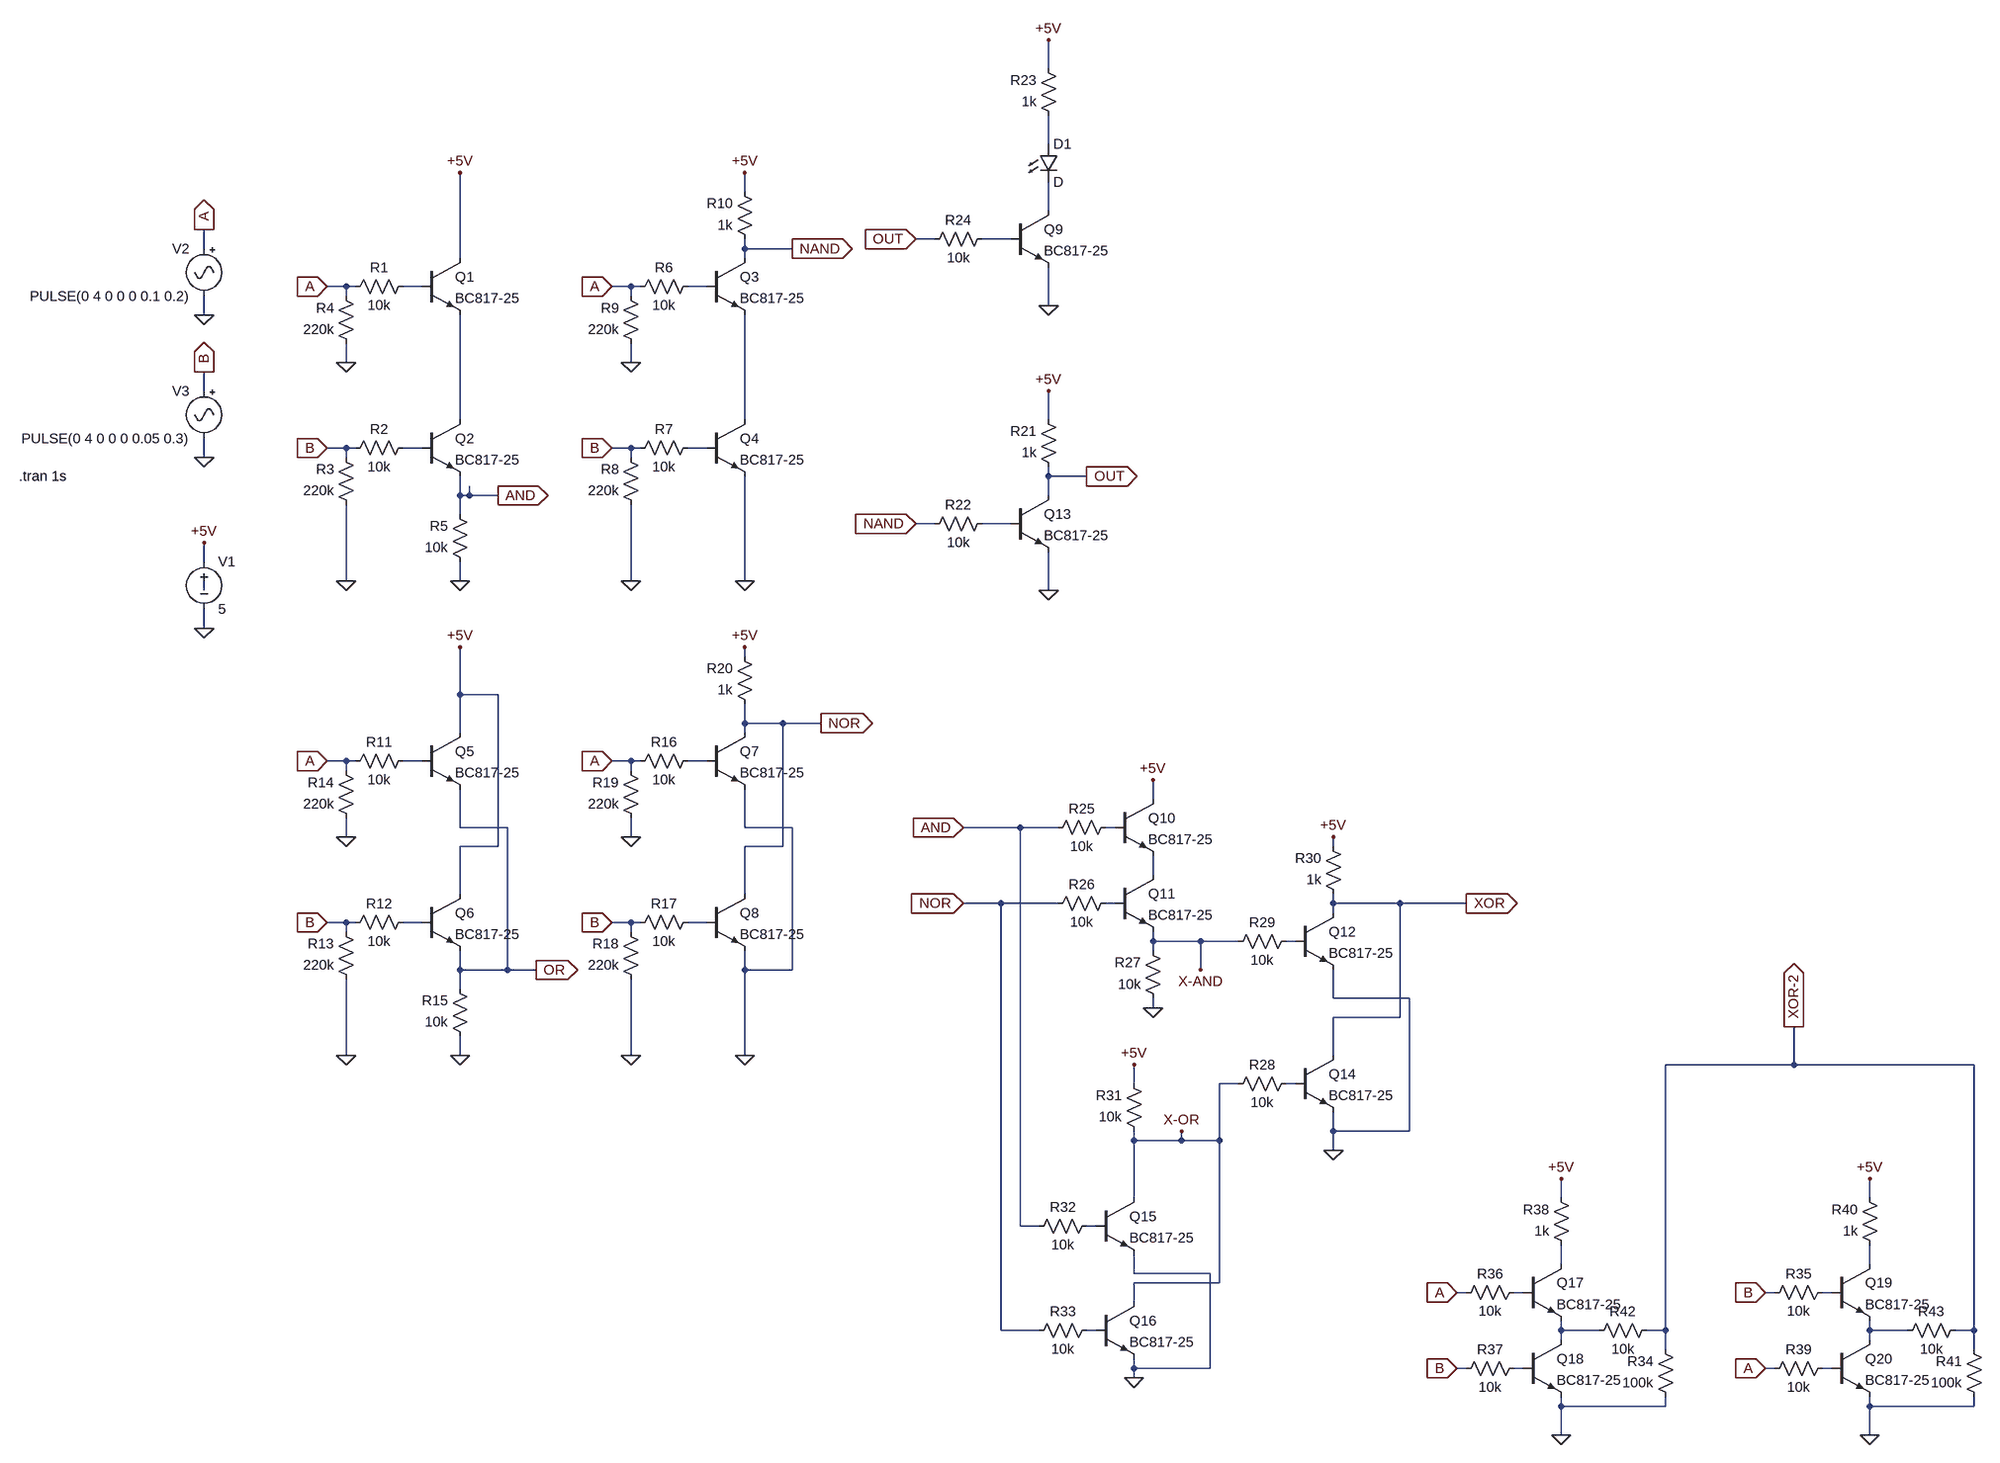
[diagram p0: schematic basic-gates.asc]
basic-gates.asc, the LTspice schematic file:
Version 4
SHEET 1 3012 1972
WIRE 1184 -352 1184 -400
WIRE 1184 -224 1184 -272
WIRE 672 -144 672 -176
WIRE 1184 -112 1184 -160
WIRE 992 -64 960 -64
WIRE 1120 -64 1072 -64
WIRE -256 -48 -256 -80
WIRE 672 -48 672 -64
WIRE 752 -48 672 -48
WIRE 192 -32 192 -176
WIRE 672 -32 672 -48
WIRE 0 16 -32 16
WIRE 16 16 0 16
WIRE 128 16 96 16
WIRE 480 16 448 16
WIRE 496 16 480 16
WIRE 608 16 576 16
WIRE 0 32 0 16
WIRE 480 32 480 16
WIRE 1184 48 1184 -16
WIRE -256 64 -256 32
WIRE 0 144 0 112
WIRE 480 144 480 112
WIRE -256 192 -256 160
WIRE 192 240 192 64
WIRE 672 240 672 64
WIRE 1184 240 1184 192
WIRE 0 288 -32 288
WIRE 16 288 0 288
WIRE 128 288 96 288
WIRE 480 288 448 288
WIRE 496 288 480 288
WIRE 608 288 576 288
WIRE -256 304 -256 272
WIRE 0 304 0 288
WIRE 480 304 480 288
WIRE 1184 336 1184 320
WIRE 1248 336 1184 336
WIRE 192 368 192 336
WIRE 208 368 208 352
WIRE 208 368 192 368
WIRE 256 368 208 368
WIRE 1184 368 1184 336
WIRE 192 400 192 368
WIRE 992 416 960 416
WIRE 1120 416 1072 416
WIRE -256 480 -256 448
WIRE 0 512 0 384
WIRE 192 512 192 480
WIRE 480 512 480 384
WIRE 672 512 672 336
WIRE -256 528 -256 512
WIRE 1184 528 1184 464
WIRE -256 592 -256 560
WIRE 672 640 672 624
WIRE 192 704 192 624
WIRE 256 704 192 704
WIRE 672 752 672 720
WIRE 736 752 672 752
WIRE 800 752 736 752
WIRE 192 768 192 704
WIRE 672 768 672 752
WIRE 0 816 -32 816
WIRE 16 816 0 816
WIRE 128 816 96 816
WIRE 480 816 448 816
WIRE 496 816 480 816
WIRE 608 816 576 816
WIRE 0 832 0 816
WIRE 480 832 480 816
WIRE 1360 880 1360 848
WIRE 192 928 192 864
WIRE 272 928 192 928
WIRE 672 928 672 864
WIRE 752 928 672 928
WIRE 1136 928 1040 928
WIRE 1200 928 1136 928
WIRE 1296 928 1280 928
WIRE 0 944 0 912
WIRE 480 944 480 912
WIRE 256 960 256 704
WIRE 256 960 192 960
WIRE 736 960 736 752
WIRE 736 960 672 960
WIRE 1664 960 1664 944
WIRE 1360 1008 1360 976
WIRE 192 1040 192 960
WIRE 672 1040 672 960
WIRE 1104 1056 1040 1056
WIRE 1200 1056 1104 1056
WIRE 1296 1056 1280 1056
WIRE 1664 1056 1664 1040
WIRE 1776 1056 1664 1056
WIRE 1888 1056 1776 1056
WIRE 1664 1072 1664 1056
WIRE 0 1088 -32 1088
WIRE 16 1088 0 1088
WIRE 128 1088 96 1088
WIRE 480 1088 448 1088
WIRE 496 1088 480 1088
WIRE 608 1088 576 1088
WIRE 0 1104 0 1088
WIRE 480 1104 480 1088
WIRE 1360 1120 1360 1104
WIRE 1440 1120 1360 1120
WIRE 1504 1120 1440 1120
WIRE 1600 1120 1584 1120
WIRE 1360 1136 1360 1120
WIRE 192 1168 192 1136
WIRE 272 1168 272 928
WIRE 272 1168 192 1168
WIRE 320 1168 272 1168
WIRE 672 1168 672 1136
WIRE 752 1168 752 928
WIRE 752 1168 672 1168
WIRE 1440 1168 1440 1120
WIRE 192 1200 192 1168
WIRE 1664 1216 1664 1168
WIRE 1792 1216 1664 1216
WIRE 1360 1232 1360 1216
WIRE 1776 1248 1776 1056
WIRE 1776 1248 1664 1248
WIRE 0 1312 0 1184
WIRE 192 1312 192 1280
WIRE 480 1312 480 1184
WIRE 672 1312 672 1168
WIRE 1664 1312 1664 1248
WIRE 2480 1328 2480 1264
WIRE 2480 1328 2224 1328
WIRE 2784 1328 2480 1328
WIRE 1328 1360 1328 1328
WIRE 1504 1360 1472 1360
WIRE 1600 1360 1584 1360
WIRE 1664 1440 1664 1408
WIRE 1792 1440 1792 1216
WIRE 1792 1440 1664 1440
WIRE 1328 1456 1328 1440
WIRE 1408 1456 1408 1440
WIRE 1408 1456 1328 1456
WIRE 1472 1456 1472 1360
WIRE 1472 1456 1408 1456
WIRE 1664 1472 1664 1440
WIRE 1328 1552 1328 1456
WIRE 2048 1552 2048 1520
WIRE 2608 1552 2608 1520
WIRE 1136 1600 1136 928
WIRE 1168 1600 1136 1600
WIRE 1264 1600 1248 1600
WIRE 2048 1664 2048 1632
WIRE 2608 1664 2608 1632
WIRE 1328 1680 1328 1648
WIRE 1456 1680 1328 1680
WIRE 1472 1696 1472 1456
WIRE 1472 1696 1328 1696
WIRE 1888 1712 1872 1712
WIRE 1984 1712 1968 1712
WIRE 2448 1712 2432 1712
WIRE 2544 1712 2528 1712
WIRE 1328 1728 1328 1696
WIRE 1104 1776 1104 1056
WIRE 1168 1776 1104 1776
WIRE 1264 1776 1248 1776
WIRE 2048 1776 2048 1760
WIRE 2112 1776 2048 1776
WIRE 2224 1776 2224 1328
WIRE 2224 1776 2192 1776
WIRE 2608 1776 2608 1760
WIRE 2672 1776 2608 1776
WIRE 2784 1776 2784 1328
WIRE 2784 1776 2752 1776
WIRE 2048 1792 2048 1776
WIRE 2608 1792 2608 1776
WIRE 2224 1808 2224 1776
WIRE 2784 1808 2784 1776
WIRE 1328 1840 1328 1824
WIRE 1456 1840 1456 1680
WIRE 1456 1840 1328 1840
WIRE 1888 1840 1872 1840
WIRE 1984 1840 1968 1840
WIRE 2448 1840 2432 1840
WIRE 2544 1840 2528 1840
WIRE 1328 1856 1328 1840
WIRE 2048 1904 2048 1888
WIRE 2224 1904 2224 1888
WIRE 2224 1904 2048 1904
WIRE 2608 1904 2608 1888
WIRE 2784 1904 2784 1888
WIRE 2784 1904 2608 1904
WIRE 2048 1952 2048 1904
WIRE 2608 1952 2608 1904
FLAG 192 512 0
FLAG 0 144 0
FLAG 0 512 0
FLAG -256 592 0
FLAG -256 64 0
FLAG -256 304 0
FLAG -256 448 +5V
FLAG 192 -176 +5V
FLAG -256 -80 A
IOPIN -256 -80 Out
FLAG -256 160 B
IOPIN -256 160 Out
FLAG -32 16 A
IOPIN -32 16 In
FLAG -32 288 B
IOPIN -32 288 In
FLAG 256 368 AND
IOPIN 256 368 Out
FLAG 672 512 0
FLAG 480 144 0
FLAG 480 512 0
FLAG 1184 192 +5V
FLAG 448 16 A
IOPIN 448 16 In
FLAG 448 288 B
IOPIN 448 288 In
FLAG 752 -48 NAND
IOPIN 752 -48 Out
FLAG 192 1312 0
FLAG 0 944 0
FLAG 0 1312 0
FLAG 192 624 +5V
FLAG -32 816 A
IOPIN -32 816 In
FLAG -32 1088 B
IOPIN -32 1088 In
FLAG 320 1168 OR
IOPIN 320 1168 Out
FLAG 672 1312 0
FLAG 480 944 0
FLAG 480 1312 0
FLAG 672 624 +5V
FLAG 448 816 A
IOPIN 448 816 In
FLAG 448 1088 B
IOPIN 448 1088 In
FLAG 800 752 NOR
IOPIN 800 752 Out
FLAG 1184 528 0
FLAG 960 416 NAND
IOPIN 960 416 In
FLAG 1248 336 OUT
IOPIN 1248 336 Out
FLAG 672 -176 +5V
FLAG 1184 -400 +5V
FLAG 1184 48 0
FLAG 960 -64 OUT
IOPIN 960 -64 In
FLAG 1360 848 +5V
FLAG 1360 1232 0
FLAG 1040 928 AND
IOPIN 1040 928 In
FLAG 1040 1056 NOR
IOPIN 1040 1056 In
FLAG 1664 1472 0
FLAG 1664 944 +5V
FLAG 1888 1056 XOR
IOPIN 1888 1056 Out
FLAG 1328 1328 +5V
FLAG 1328 1856 0
FLAG 1440 1168 X-AND
FLAG 1408 1440 X-OR
FLAG 2048 1520 +5V
FLAG 2048 1952 0
FLAG 1872 1840 B
IOPIN 1872 1840 In
FLAG 1872 1712 A
IOPIN 1872 1712 In
FLAG 2608 1520 +5V
FLAG 2608 1952 0
FLAG 2432 1840 A
IOPIN 2432 1840 In
FLAG 2432 1712 B
IOPIN 2432 1712 In
FLAG 2480 1264 XOR-2
IOPIN 2480 1264 Out
SYMBOL npn 128 -32 R0
SYMATTR InstName Q1
SYMATTR Value BC817-25
SYMBOL npn 128 240 R0
SYMATTR InstName Q2
SYMATTR Value BC817-25
SYMBOL voltage -256 464 R0
WINDOW 123 0 0 Left 2
WINDOW 39 0 0 Left 2
SYMATTR InstName V1
SYMATTR Value 5
SYMBOL res 112 0 R90
WINDOW 0 0 56 VBottom 2
WINDOW 3 32 56 VTop 2
SYMATTR InstName R1
SYMATTR Value 10k
SYMBOL res 112 272 R90
WINDOW 0 0 56 VBottom 2
WINDOW 3 32 56 VTop 2
SYMATTR InstName R2
SYMATTR Value 10k
SYMBOL res 16 400 R180
WINDOW 0 36 76 Left 2
WINDOW 3 36 40 Left 2
SYMATTR InstName R3
SYMATTR Value 220k
SYMBOL res 16 128 R180
WINDOW 0 36 76 Left 2
WINDOW 3 36 40 Left 2
SYMATTR InstName R4
SYMATTR Value 220k
SYMBOL res 208 496 R180
WINDOW 0 36 76 Left 2
WINDOW 3 36 40 Left 2
SYMATTR InstName R5
SYMATTR Value 10k
SYMBOL Misc\\signal -256 -64 M0
WINDOW 123 0 0 Left 2
WINDOW 39 0 0 Left 2
SYMATTR InstName V2
SYMATTR Value PULSE(0 4 0 0 0 0.1 0.2)
SYMBOL Misc\\signal -256 176 M0
WINDOW 123 0 0 Left 2
WINDOW 39 0 0 Left 2
SYMATTR InstName V3
SYMATTR Value PULSE(0 4 0 0 0 0.05 0.3)
SYMBOL npn 608 -32 R0
SYMATTR InstName Q3
SYMATTR Value BC817-25
SYMBOL npn 608 240 R0
SYMATTR InstName Q4
SYMATTR Value BC817-25
SYMBOL res 592 0 R90
WINDOW 0 0 56 VBottom 2
WINDOW 3 32 56 VTop 2
SYMATTR InstName R6
SYMATTR Value 10k
SYMBOL res 592 272 R90
WINDOW 0 0 56 VBottom 2
WINDOW 3 32 56 VTop 2
SYMATTR InstName R7
SYMATTR Value 10k
SYMBOL res 496 400 R180
WINDOW 0 36 76 Left 2
WINDOW 3 36 40 Left 2
SYMATTR InstName R8
SYMATTR Value 220k
SYMBOL res 496 128 R180
WINDOW 0 36 76 Left 2
WINDOW 3 36 40 Left 2
SYMATTR InstName R9
SYMATTR Value 220k
SYMBOL res 688 -48 R180
WINDOW 0 36 76 Left 2
WINDOW 3 36 40 Left 2
SYMATTR InstName R10
SYMATTR Value 1k
SYMBOL npn 128 768 R0
SYMATTR InstName Q5
SYMATTR Value BC817-25
SYMBOL npn 128 1040 R0
SYMATTR InstName Q6
SYMATTR Value BC817-25
SYMBOL res 112 800 R90
WINDOW 0 0 56 VBottom 2
WINDOW 3 32 56 VTop 2
SYMATTR InstName R11
SYMATTR Value 10k
SYMBOL res 112 1072 R90
WINDOW 0 0 56 VBottom 2
WINDOW 3 32 56 VTop 2
SYMATTR InstName R12
SYMATTR Value 10k
SYMBOL res 16 1200 R180
WINDOW 0 36 76 Left 2
WINDOW 3 36 40 Left 2
SYMATTR InstName R13
SYMATTR Value 220k
SYMBOL res 16 928 R180
WINDOW 0 36 76 Left 2
WINDOW 3 36 40 Left 2
SYMATTR InstName R14
SYMATTR Value 220k
SYMBOL res 208 1296 R180
WINDOW 0 36 76 Left 2
WINDOW 3 36 40 Left 2
SYMATTR InstName R15
SYMATTR Value 10k
SYMBOL npn 608 768 R0
SYMATTR InstName Q7
SYMATTR Value BC817-25
SYMBOL npn 608 1040 R0
SYMATTR InstName Q8
SYMATTR Value BC817-25
SYMBOL res 592 800 R90
WINDOW 0 0 56 VBottom 2
WINDOW 3 32 56 VTop 2
SYMATTR InstName R16
SYMATTR Value 10k
SYMBOL res 592 1072 R90
WINDOW 0 0 56 VBottom 2
WINDOW 3 32 56 VTop 2
SYMATTR InstName R17
SYMATTR Value 10k
SYMBOL res 496 1200 R180
WINDOW 0 36 76 Left 2
WINDOW 3 36 40 Left 2
SYMATTR InstName R18
SYMATTR Value 220k
SYMBOL res 496 928 R180
WINDOW 0 36 76 Left 2
WINDOW 3 36 40 Left 2
SYMATTR InstName R19
SYMATTR Value 220k
SYMBOL res 688 736 R180
WINDOW 0 36 76 Left 2
WINDOW 3 36 40 Left 2
SYMATTR InstName R20
SYMATTR Value 1k
SYMBOL npn 1120 368 R0
SYMATTR InstName Q13
SYMATTR Value BC817-25
SYMBOL res 1200 336 R180
WINDOW 0 36 76 Left 2
WINDOW 3 36 40 Left 2
SYMATTR InstName R21
SYMATTR Value 1k
SYMBOL res 1088 400 R90
WINDOW 0 0 56 VBottom 2
WINDOW 3 32 56 VTop 2
SYMATTR InstName R22
SYMATTR Value 10k
SYMBOL npn 1120 -112 R0
SYMATTR InstName Q9
SYMATTR Value BC817-25
SYMBOL res 1200 -256 R180
WINDOW 0 36 76 Left 2
WINDOW 3 36 40 Left 2
SYMATTR InstName R23
SYMATTR Value 1k
SYMBOL res 1088 -80 R90
WINDOW 0 0 56 VBottom 2
WINDOW 3 32 56 VTop 2
SYMATTR InstName R24
SYMATTR Value 10k
SYMBOL LED 1168 -224 R0
SYMATTR InstName D1
SYMBOL npn 1296 880 R0
SYMATTR InstName Q10
SYMATTR Value BC817-25
SYMBOL npn 1296 1008 R0
SYMATTR InstName Q11
SYMATTR Value BC817-25
SYMBOL res 1296 912 R90
WINDOW 0 0 56 VBottom 2
WINDOW 3 32 56 VTop 2
SYMATTR InstName R25
SYMATTR Value 10k
SYMBOL res 1296 1040 R90
WINDOW 0 0 56 VBottom 2
WINDOW 3 32 56 VTop 2
SYMATTR InstName R26
SYMATTR Value 10k
SYMBOL res 1376 1232 R180
WINDOW 0 36 76 Left 2
WINDOW 3 36 40 Left 2
SYMATTR InstName R27
SYMATTR Value 10k
SYMBOL npn 1600 1072 R0
SYMATTR InstName Q12
SYMATTR Value BC817-25
SYMBOL npn 1600 1312 R0
SYMATTR InstName Q14
SYMATTR Value BC817-25
SYMBOL res 1600 1344 R90
WINDOW 0 0 56 VBottom 2
WINDOW 3 32 56 VTop 2
SYMATTR InstName R28
SYMATTR Value 10k
SYMBOL res 1600 1104 R90
WINDOW 0 0 56 VBottom 2
WINDOW 3 32 56 VTop 2
SYMATTR InstName R29
SYMATTR Value 10k
SYMBOL res 1680 1056 R180
WINDOW 0 36 76 Left 2
WINDOW 3 36 40 Left 2
SYMATTR InstName R30
SYMATTR Value 1k
SYMBOL npn 1264 1552 R0
SYMATTR InstName Q15
SYMATTR Value BC817-25
SYMBOL npn 1264 1728 R0
SYMATTR InstName Q16
SYMATTR Value BC817-25
SYMBOL res 1344 1456 R180
WINDOW 0 36 76 Left 2
WINDOW 3 36 40 Left 2
SYMATTR InstName R31
SYMATTR Value 10k
SYMBOL res 1264 1584 R90
WINDOW 0 0 56 VBottom 2
WINDOW 3 32 56 VTop 2
SYMATTR InstName R32
SYMATTR Value 10k
SYMBOL res 1264 1760 R90
WINDOW 0 0 56 VBottom 2
WINDOW 3 32 56 VTop 2
SYMATTR InstName R33
SYMATTR Value 10k
SYMBOL npn 1984 1664 R0
SYMATTR InstName Q17
SYMATTR Value BC817-25
SYMBOL npn 1984 1792 R0
SYMATTR InstName Q18
SYMATTR Value BC817-25
SYMBOL res 1984 1696 R90
WINDOW 0 0 56 VBottom 2
WINDOW 3 32 56 VTop 2
SYMATTR InstName R36
SYMATTR Value 10k
SYMBOL res 1984 1824 R90
WINDOW 0 0 56 VBottom 2
WINDOW 3 32 56 VTop 2
SYMATTR InstName R37
SYMATTR Value 10k
SYMBOL res 2064 1648 R180
WINDOW 0 36 76 Left 2
WINDOW 3 36 40 Left 2
SYMATTR InstName R38
SYMATTR Value 1k
SYMBOL res 2240 1904 R180
WINDOW 0 36 76 Left 2
WINDOW 3 36 40 Left 2
SYMATTR InstName R34
SYMATTR Value 100k
SYMBOL npn 2544 1664 R0
SYMATTR InstName Q19
SYMATTR Value BC817-25
SYMBOL npn 2544 1792 R0
SYMATTR InstName Q20
SYMATTR Value BC817-25
SYMBOL res 2544 1696 R90
WINDOW 0 0 56 VBottom 2
WINDOW 3 32 56 VTop 2
SYMATTR InstName R35
SYMATTR Value 10k
SYMBOL res 2544 1824 R90
WINDOW 0 0 56 VBottom 2
WINDOW 3 32 56 VTop 2
SYMATTR InstName R39
SYMATTR Value 10k
SYMBOL res 2624 1648 R180
WINDOW 0 36 76 Left 2
WINDOW 3 36 40 Left 2
SYMATTR InstName R40
SYMATTR Value 1k
SYMBOL res 2800 1904 R180
WINDOW 0 36 76 Left 2
WINDOW 3 36 40 Left 2
SYMATTR InstName R41
SYMATTR Value 100k
SYMBOL res 2208 1760 R90
WINDOW 0 0 56 VBottom 2
WINDOW 3 32 56 VTop 2
SYMATTR InstName R42
SYMATTR Value 10k
SYMBOL res 2768 1760 R90
WINDOW 0 0 56 VBottom 2
WINDOW 3 32 56 VTop 2
SYMATTR InstName R43
SYMATTR Value 10k
TEXT -568 336 Left 2 !.tran 1s

The netlist it stands for:
* basic-gates.asc
Q1 +5V N004 N006 0 BC817-25
Q2 N006 N008 AND 0 BC817-25
V1 +5V 0 5
R1 N004 A 10k
R2 N008 B 10k
R3 0 B 220k
R4 0 A 220k
R5 0 AND 10k
V2 A 0 PULSE(0 4 0 0 0 0.1 0.2)
V3 B 0 PULSE(0 4 0 0 0 0.05 0.3)
Q3 NAND N005 N007 0 BC817-25
Q4 N007 N009 0 0 BC817-25
R6 N005 A 10k
R7 N009 B 10k
R8 0 B 220k
R9 0 A 220k
R10 NAND +5V 1k
Q5 +5V N012 OR 0 BC817-25
Q6 +5V N017 OR 0 BC817-25
R11 N012 A 10k
R12 N017 B 10k
R13 0 B 220k
R14 0 A 220k
R15 0 OR 10k
Q7 NOR N013 0 0 BC817-25
Q8 NOR N018 0 0 BC817-25
R16 N013 A 10k
R17 N018 B 10k
R18 0 B 220k
R19 0 A 220k
R20 NOR +5V 1k
Q13 OUT N010 0 0 BC817-25
R21 OUT +5V 1k
R22 N010 NAND 10k
Q9 N002 N003 0 0 BC817-25
R23 N001 +5V 1k
R24 N003 OUT 10k
D1 N001 N002 D
Q10 +5V N014 N015 0 BC817-25
Q11 N015 N016 X-AND 0 BC817-25
R25 N014 AND 10k
R26 N016 NOR 10k
R27 0 X-AND 10k
Q12 XOR N019 0 0 BC817-25
Q14 XOR N020 0 0 BC817-25
R28 N020 X-OR 10k
R29 N019 X-AND 10k
R30 XOR +5V 1k
Q15 X-OR N021 0 0 BC817-25
Q16 X-OR N026 0 0 BC817-25
R31 X-OR +5V 10k
R32 N021 AND 10k
R33 N026 NOR 10k
Q17 N022 N024 N027 0 BC817-25
Q18 N027 N029 0 0 BC817-25
R36 N024 A 10k
R37 N029 B 10k
R38 N022 +5V 1k
R34 0 XOR-2 100k
Q19 N023 N025 N028 0 BC817-25
Q20 N028 N030 0 0 BC817-25
R35 N025 B 10k
R39 N030 A 10k
R40 N023 +5V 1k
R41 0 XOR-2 100k
R42 XOR-2 N027 10k
R43 XOR-2 N028 10k
.model D D
.lib standard.dio
.model NPN NPN
.model PNP PNP
.lib standard.bjt
.tran 1s
.backanno
.end